# Altium project esp_dual.PrjPcb
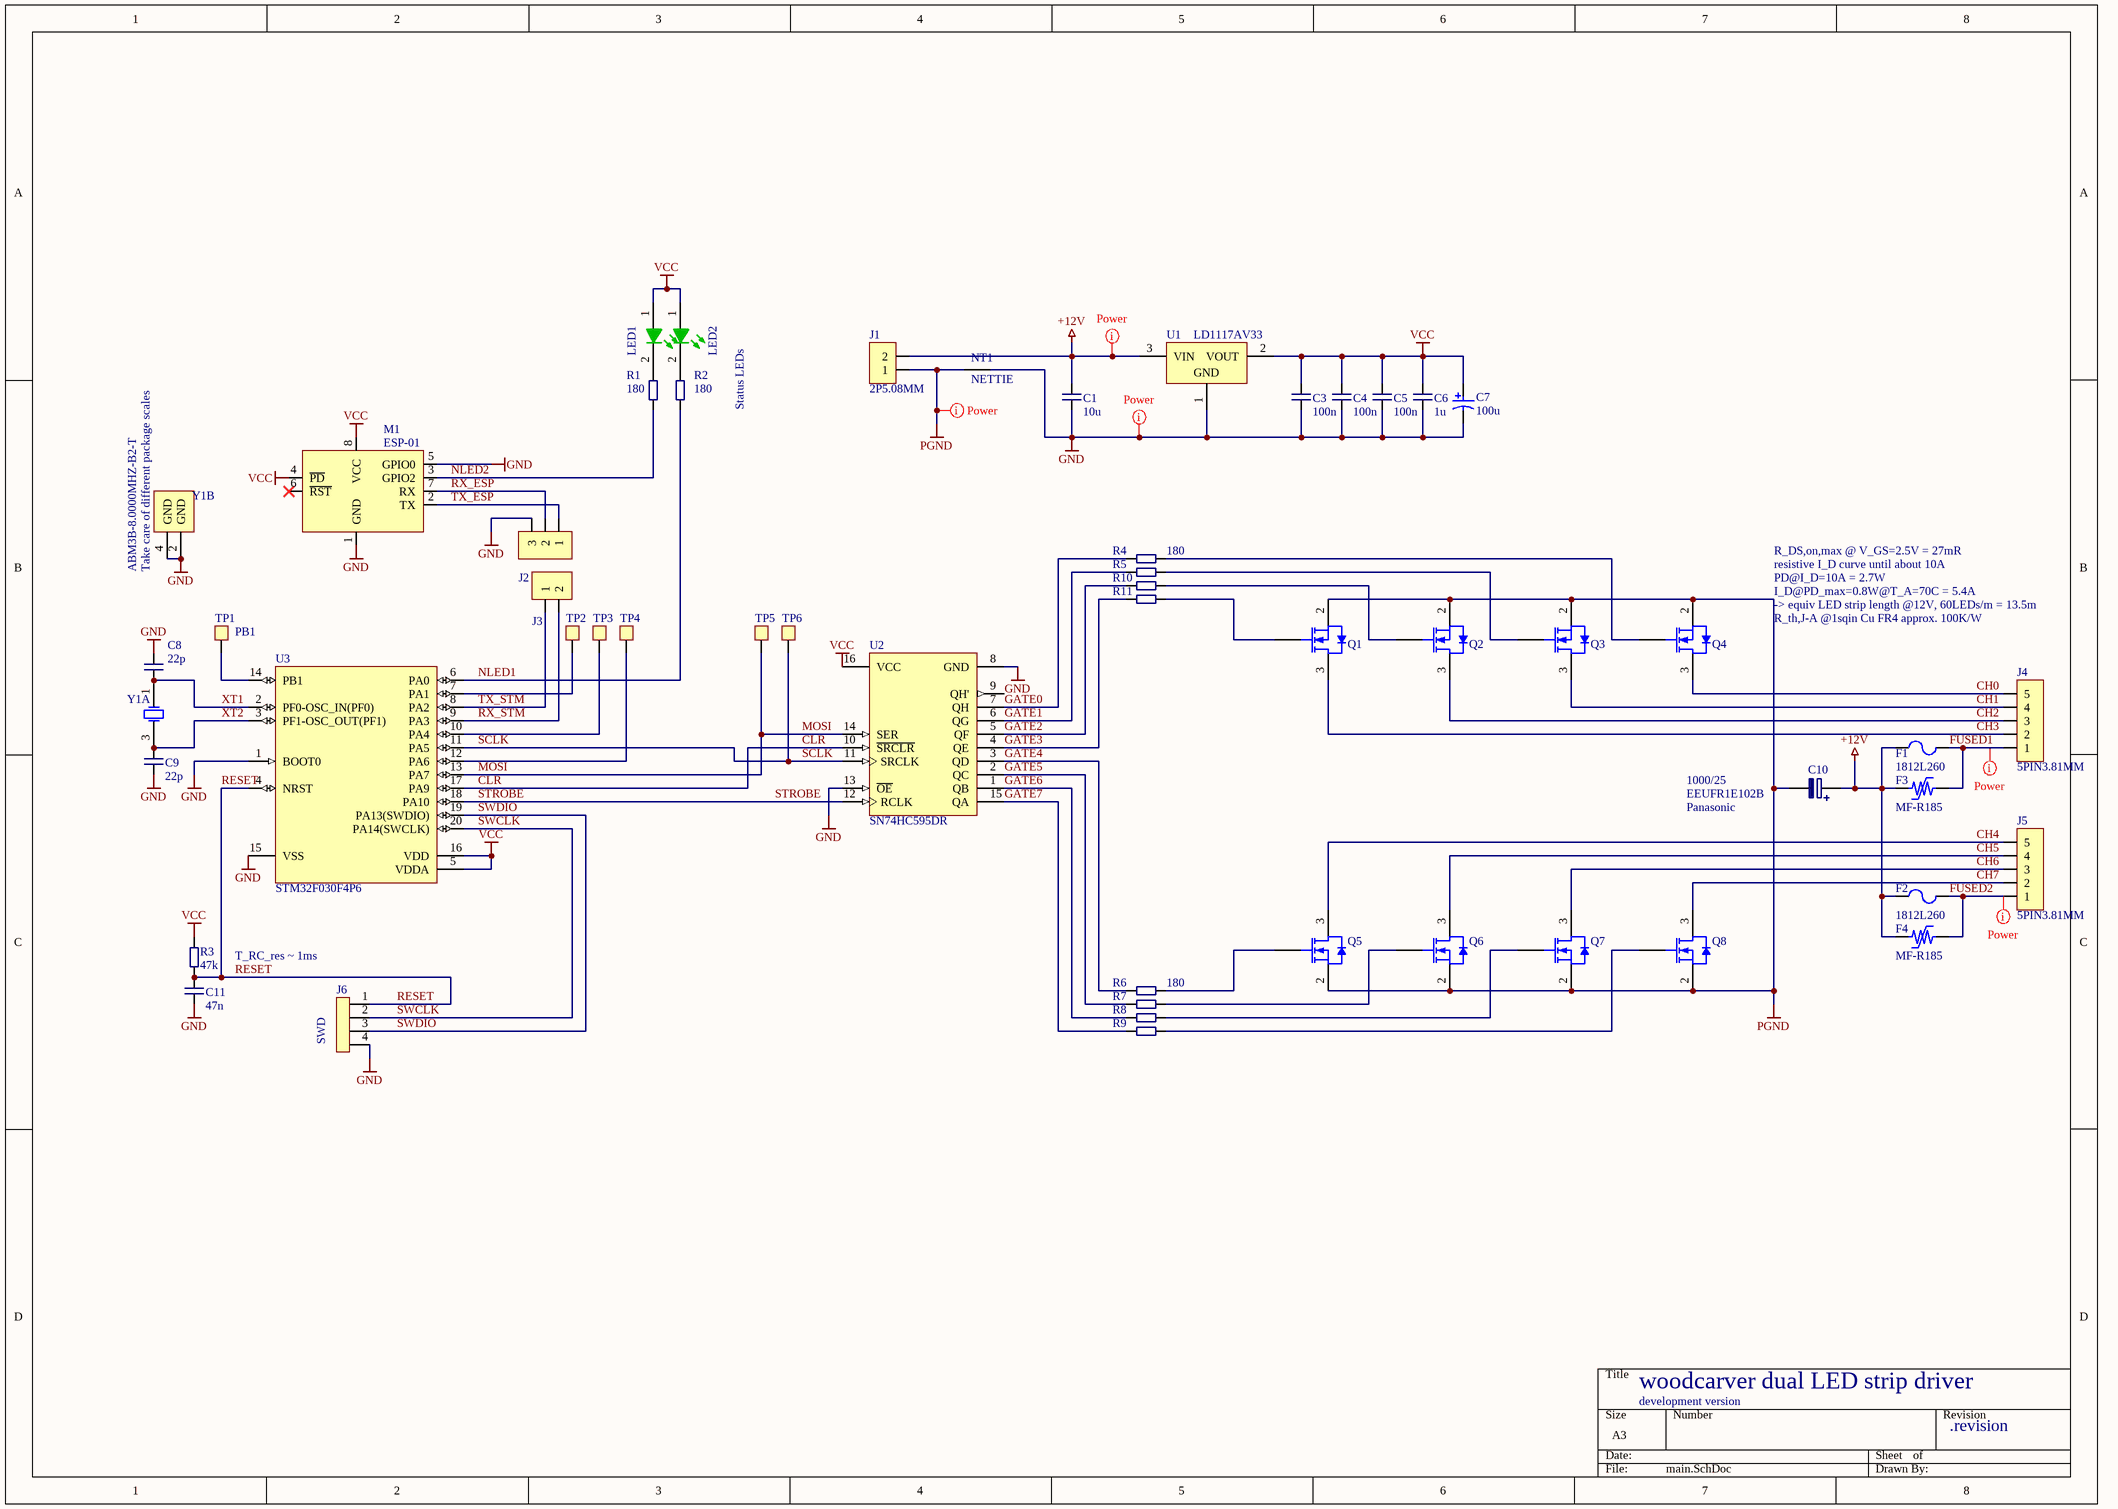
[diagram p0: main.SchDoc]
1 sheet, 53 parts. Net scope: global (net labels, ports and power ports of the same name join across sheets).
Board file: main.PcbDoc

## Sheet main.SchDoc
size A3; Revision: 1

### Parts
C1  10u  [6-0805_M]
C3  100n  [J1-0603]
C4  100n  [J1-0603]
C5  100n  [J1-0603]
C6  1u  [6-0805_M]
C7  100u  [FHTE-8-AA07-2_N]
C8  22p  [J1-0603]
C9  22p  [J1-0603]
C10  1000/25  Mfg Part No: EEUFR1E102B  Mfg: Panasonic  [ELKO_10MM_RM5_SIDE_25MM]
C11  47n  [J1-0603]
F1  1812L260  [LFUS-FUSE1812-71_V]
F2  1812L260  [LFUS-FUSE1812-71_V]
F3  MF-R185  [BOUR-MF-R185]
F4  MF-R185  [BOUR-MF-R185]
J1  2P5.08MM  [HEADER_2PIN_RM5.08MM_PLUGGABLE]
J2  PINHD_1x3_2.54MM  [PINHD_3X1_2.54MM]  (value not drawn)
J3  PINHD_1x2_2.54MM  [PINHD_2X1_2.54MM]  (value not drawn)
J4  5PIN3.81MM  [HEADER_5PIN_RM3.81MM_PLUGGABLE]
J5  5PIN3.81MM  [HEADER_5PIN_RM3.81MM_PLUGGABLE]
J6  SWD  [PINHD_4X1_2.54MM]
LED1  KP-1608MGC  [KING-0603LED_GREEN_V]  (value not drawn)
LED2  KP-1608MGC  [KING-0603LED_GREEN_V]  (value not drawn)
M1  ESP-01  [ESP01]
NT1  NETTIE  [NETTIE]
Q1  IRLML6244TRPbF  [ONSC-SOT-23-3-318-08_V]  (value not drawn)
Q2  IRLML6244TRPbF  [ONSC-SOT-23-3-318-08_V]  (value not drawn)
Q3  IRLML6244TRPbF  [ONSC-SOT-23-3-318-08_V]  (value not drawn)
Q4  IRLML6244TRPbF  [ONSC-SOT-23-3-318-08_V]  (value not drawn)
Q5  IRLML6244TRPbF  [ONSC-SOT-23-3-318-08_V]  (value not drawn)
Q6  IRLML6244TRPbF  [ONSC-SOT-23-3-318-08_V]  (value not drawn)
Q7  IRLML6244TRPbF  [ONSC-SOT-23-3-318-08_V]  (value not drawn)
Q8  IRLML6244TRPbF  [ONSC-SOT-23-3-318-08_V]  (value not drawn)
R1  180  [J1-0603]
R2  180  [J1-0603]
R3  47k  [J1-0603]
R4  180  [J1-0603]
R5  180  [J1-0603]  (value not drawn)
R6  180  [J1-0603]
R7  180  [J1-0603]  (value not drawn)
R8  180  [J1-0603]  (value not drawn)
R9  180  [J1-0603]  (value not drawn)
R10  180  [J1-0603]  (value not drawn)
R11  180  [J1-0603]  (value not drawn)
TP1  PB1  [TESTPOINT_2mm]
TP2  PA1  [TESTPOINT_2mm]  (value not drawn)
TP3  PA4  [TESTPOINT_2mm]  (value not drawn)
TP4  PA6  [TESTPOINT_2mm]  (value not drawn)
TP5  PA6  [TESTPOINT_2mm]  (value not drawn)
TP6  PA6  [TESTPOINT_2mm]  (value not drawn)
U1  LD1117AV33  [TO220]
U2  SN74HC595DR  [D0016A_M]
U3  STM32F030F4P6  [STM-TSSOP20_L]
Y1  ABM3B-8.0000MHZ-B2-T  [XTAL_MJ_5x3.2]  (value not drawn)  (parts A,B of 2)

### Nets
+12V: C1.1 C10.1 F1.1 F2.1 F3.1 F4.1 J1.2 U1.3(VIN)
GND: C1.2 C3.2 C4.2 C5.2 C6.2 C7.2 C8.1 C9.2 C11.2 J2.3 J6.4 M1.1(GND) M1.5(GPIO0) NT1.2 U1.1(GND) U2.8(GND) U2.13(~{OE}) U3.1(BOOT0) U3.15(VSS) Y1.2(GND) Y1.4(GND)
PGND: C10.2 J1.1 NT1.1 Q1.2(S) Q2.2(S) Q3.2(S) Q4.2(S) Q5.2(S) Q6.2(S) Q7.2(S) Q8.2(S)
VCC: C3.1 C4.1 C5.1 C6.1 C7.1 LED1.1(A) LED2.1(A) M1.4(~{PD}) M1.8(VCC) R3.2 U1.2(VOUT) U2.16(VCC) U3.5(VDDA) U3.16(VDD)
CH0: J4.5 Q4.3(D)
CH1: J4.4 Q3.3(D)
CH2: J4.3 Q2.3(D)
CH3: J4.2 Q1.3(D)
CH4: J5.5 Q5.3(D)
CH5: J5.4 Q6.3(D)
CH6: J5.3 Q7.3(D)
CH7: J5.2 Q8.3(D)
CLR: U2.10(~{SRCLR}) U3.17(PA9)
FUSED1: F1.2 F3.2 J4.1
FUSED2: F2.2 F4.2 J5.1
GATE0: R4.2 U2.7(QH)
GATE1: R5.2 U2.6(QG)
GATE2: R10.2 U2.5(QF)
GATE3: R11.2 U2.4(QE)
GATE4: R6.2 U2.3(QD)
GATE5: R7.2 U2.2(QC)
GATE6: R8.2 U2.1(QB)
GATE7: R9.2 U2.15(QA)
MOSI: TP5.1 U2.14(SER) U3.13(PA7)
NLED1: R2.1 U3.6(PA0)
NLED2: M1.3(GPIO2) R1.1
RESET: C11.1 J6.1 R3.1 U3.4(NRST)
RX_ESP: J2.2 M1.7(RX)
RX_STM: J3.2 U3.9(PA3)
SCLK: TP6.1 U2.11(SRCLK) U3.11(PA5)
STROBE: U2.12(RCLK) U3.18(PA10)
SWCLK: J6.2 U3.20(PA14(SWCLK))
SWDIO: J6.3 U3.19(PA13(SWDIO))
TX_ESP: J2.1 M1.2(TX)
TX_STM: J3.1 U3.8(PA2)
XT1: C8.2 U3.2(PF0-OSC_IN(PF0)) Y1.1(X1)
XT2: C9.1 U3.3(PF1-OSC_OUT(PF1)) Y1.3(X2)
NetLED1_2: LED1.2(K) R1.2
NetLED2_2: LED2.2(K) R2.2
NetQ1_1: Q1.1(G) R11.1
NetQ2_1: Q2.1(G) R10.1
NetQ3_1: Q3.1(G) R5.1
NetQ4_1: Q4.1(G) R4.1
NetQ5_1: Q5.1(G) R6.1
NetQ6_1: Q6.1(G) R7.1
NetQ7_1: Q7.1(G) R8.1
NetQ8_1: Q8.1(G) R9.1
NetTP1_1: TP1.1 U3.14(PB1)
NetTP2_1: TP2.1 U3.7(PA1)
NetTP3_1: TP3.1 U3.10(PA4)
NetTP4_1: TP4.1 U3.12(PA6)

Not connected (* = marked no-connect by the designer): M1 6(~{RST})*; U2 9(QH')

### Layout directives
net class power: +12V, FUSED1, FUSED2, GND, PGND

### Notes on the sheet
- Status LEDs
- R_DS,on,max @ V_GS=2.5V = 27mR
- resistive I_D curve until about 10A
- PD@I_D=10A = 2.7W
- I_D@PD_max=0.8W@T_A=70C = 5.4A
- -> equiv LED strip length @12V, 60LEDs/m = 13.5m
- R_th,J-A @1sqin Cu FR4 approx. 100K/W
- T_RC_res ~ 1ms
- woodcarver dual LED strip driver
- development version
- .revision

### Library data of the parts
C1 C3-C6 C8 C9 C11 = C: Capacitor
C7 = CMP-0909-00002-1: Aluminum Electrolytic Capacitor, 470 uF +/- 5%, 16 V, -40 to 105 degC, 2 Pin THD, Dia 6.3 mm, Body Length 7 mm, Tape and Reel; Manufacturer: Fenghuang Technology; PartNumber: 8471LCJAA07WPN081T; Nominal Capacitance: 470 uF; Tolerance: +/- 5%; Voltage: 16 V; Seeve Color: Balck; PackageReference: 8-AA07-2; ComponentLink1URL: http://www.fenghua-advanced.com/; DatasheetVersion: Feb-13; Packing: Tape and Reel; Mounting Technology: Through Hole; Operating Temperature: -40 to 105 degC; ComponentLink2URL: http://218.15.223.226:8089/BusinessProductPdf/ss_20130228152314.pdf; ComponentLink2Description: Datasheet; ComponentLink1Description: Manufacturer URL; PackageDescription: 2-Pin Through Hole Cap, Dia 6.3 mm, Body Length 7 mm
C10 = ELKO
F1 F2 = CMP-0257-00001-1: Resettable PTC, 1812, 1.5 A Ihold, 3.0 A Itrip; PartNumber: 1812L150ZR; Itrip: 3 A; Vmax: 8 Vdc; Ihold: 1.5 A; Imax: 100 A; PackageReference: FUSE1812-71; ComponentLink1Description: Manufacturer URL; DatasheetVersion: 6/2012; ComponentLink2URL: http://www.littelfuse.com/products/resettable-ptcs/surface-mount/1812l/~/media/Electronics_Technical/Datasheets/Resettable_PTCs/Littelfuse_PTC_1812L_Datasheet.pdf; PackageVersion: 6/2012; PackageDescription: 2-Pin SMT Fuse, 4.55 x 3.24 mm Body; ComponentLink1URL: http://www.littelfuse.com/; ComponentLink2Description: Datasheet
F3 F4 = CMP-2000-06695-1: PTC Resettable Fuse, 30 V, 40 A, -40 to 85 degC, 2-Pin THD, RoHS, Bulk; Manufacturer: Bourns; Maximum Current Rating: 40A; Maximum Initial Resistance: 0.07Ohm; Typical Power Dissipation: 1W; Maximum Voltage Rating: 30V; Maximum Post Trip Resistance: 0.11Ohm; Minimum Initial Resistance: 0.04Ohm; Wire Form: InsideCrimpStandoff; Lead Diameter: 0.51mm; COO: CN; Maximum Trip Time: 8.7@9.25As; Agency Approvals: CSA/TUV/UL; Hold Current: 1.85A; Trip Current: 3.7A; Manufacturer URL: http://www.bourns.com/; Applications: AutomotiveApplications,ComputersandPeripherals,GeneralElectronics; Datasheet URL: http://www.bourns.com/docs/Product-Datasheets/mfr.pdf; Terminal Pitch: 5.1(Nom)mm; Packaging: Bulk; Package/Case: N/A; Dimension: 3(Max)x12(Max)mm; Package Description: 2-Pin Through Hole Device, Body 12 x 3 mm; Family: MF-R; Mounting: ThroughHole; Supplier: Bourns; Seated Plane Height: 18.4(Max)mm; Part No: MF-R185; Number of Terminals: 2; Package Reference: MF-R185; RoHS: Yes; Supplier Standard Pack: 500; HTS: 8536100040; Datasheet Version: 08/2015; Operating Temperature: -40to85C; ECCN: EAR99; Mounting Technology: ThroughHole
J1 = PHD2P5.08RM: Pluggable Header 2 Pin RM 5.08mm ~15A
J2 = PINHD1X3: Pin Header 1 row 3 pin RM 2.54mm
J3 = PINHD1X2: Pin Header 1 row 2 pin RM 2.54mm
J4 J5 = PHD5P3.81RM: Pluggable Header 5 Pin RM 3.81mm ~8A
J6 = PH_4x1: Pin Header 4x1 pin
LED1 LED2 = CMP-0404-00001-1: LED, SMT, 0603(1608), 1.1mm thickness, Green; Manufacturer: Kingbright; Reverse Voltage: 5 V; Power Dissipation: 75 mW; Forward Current: 30 mA; Packing Type: 2000 pcs / reel; Mounting Technology: Surface Mount; Storage Temperature: -40 to +85 degC; ComponentLink1URL: http://www.kingbright.com/; PackageDescription: 2-Pin SMT LED, 1.6 x 0.8 mm Pitch; PartNumber: KP-1608MGC; PackageReference: 0603LED_GREEN; ComponentLink1Description: Manufacturer URL
M1 = ESP01: ESP-01 ESP8266 Wifi Module
Q1-Q8 = CMP-1058-00794-1: Power MOSFET, 500 mA, 60 V, N-Channel, 3-Pin SOT-23, Pb-Free, Tape and Reel; Manufacturer: On Semiconductor; PartNumber: NVBF170LT1G; ID Max (A): 0.5; V(BR)DSS Min (V): 60; Configuration: Single; Channel Polarity: N Channel; PD Max (W): 0.225; VGS(th) Max (V): 3; VGS Max (V): 20; ComponentLink3URL: http://www.onsemi.cn/pub_link/Collateral/318-08.PDF; Mounting Technology: Surface Mount; ComponentLink2URL: http://www.onsemi.cn/pub_link/Collateral/MMBF170LT1-D.PDF; RoHS: Pb-Free; ComponentLink2Description: Datasheet; ComponentLink1URL: http://www.onsemi.com/; Package Type: SOT-23-3; Packing: Tape and Reel; DatasheetVersion: Rev. 9; PackageDescription: 3-Pin Small Outline Transistor, Body 2.92 x 1.3 mm, Pitch 0.95 mm; PackageVersion: Rev. AP, 11/2009; ComponentLink3Description: Package Specification; ComponentLink1Description: Manufacturer URL; PackageReference: SOT-23-3-318-08
R1-R11 = R: Resistor
TP1-TP6 = TESTPOINT
U1 = CMP-0244-00460-1: 1A, Low Drop Positive Voltage Regulator, 3.3V, 3-Pin TO-220; ComponentLink1URL: http://www.st.com; PackageDescription: TO, Thru-Hole, Vertical, Heatsink Mounted; 3 In-Line Leads; Pitch 2.54 mm; PackageVersion: ver3.0; ComponentLink3URL: http://www.st.com/internet/com/TECHNICAL_RESOURCES/TECHNICAL_LITERATURE/PACKAGE_INFORMATION/CD00004649.pdf; ComponentLink3Description: Package Specification; ComponentLink1Description: Manufacturer URL; ComponentLink2URL: http://www.st.com/internet/com/TECHNICAL_RESOURCES/TECHNICAL_LITERATURE/DATASHEET/CD00002116.pdf; PackageReference: TO220; DatasheetVersion: 2/12/2011; ComponentLink2Description: Datasheet
U2 = CMP-0780-00037-3: 8-Bit Shift Registers With 3-State Output Registers, D0016A, LARGE T&R; Manufacturer: Texas Instruments; Output Drive (IOL/IOH)(Max)(mA): 7.8/-7.8; Rating: Military; ICC @ Nom Voltage(Max)(mA): 0.08; VCC(Min)(V): 2; tpd @ Nom Voltage(Max)(ns): 34; 3-State Output: Yes; Output Type: CMOS; Voltage(Nom)(V): 6; F @ Nom Voltage(Max)(Mhz): 28; Technology Family: HC; Bits: 4; PackageReference: D0016A; Code_JEDEC: MS-012 variation AC; Generic Part Number: SN74HC595; Operating Temperature Range(C): -40 to 85; DatasheetVersion: SCLS041H; PackageVersion: http://www.ti.com/lit/ml/mpds178g/mpds178g.pdf; Input Type: CMOS; VCC(Max)(V): 6
U3 = CMP-0304-00039-2: ARM Cortex-M0 32-bit MCU, 16 KB Flash, 4 KB Internal RAM, 15 I/Os, 20-pin TSSOP, -40 to 85 degC, Tube; I/Os (High Current): 15; FLASH Size (Prog) (kB): 16; Internal RAM Size (kB): 4; Supply Voltage(Vcc) min (V): 2.4; Operating Frequency(F) (Processor speed) (MHz): 48; ComponentLink2URL: http://www.st.com/st-web-ui/static/active/en/resource/technical/document/datasheet/DM00088500.pdf; Core: ARM Cortex-M0; ComponentLink2Description: Datasheet; PackageDescription: 20-Pin Thin Shrink Small Outline Package, 6.5 x 4.4 mm Body, 0.65 mm Pitch; Mounting Technology: Surface Mount; ComponentLink1URL: http://www.st.com/web/en/home.html; PackageVersion: Rev. 1, 11/2012; ComponentLink3Description: Package Specification; PartNumber: STM32F030F4P6; ComponentLink3URL: http://www.st.com/st-web-ui/static/active/en/resource/technical/document/datasheet/DM00065136.pdf; DatasheetVersion: Rev. 1; PackageReference: TSSOP20; ComponentLink1Description: Manufacturer URL; Packing: Tube
Y1 = ABRA-ABM3B-4: Crystal, SMD, 25.000000MHz Stab=50ppm 18.0pF; Manufacturer: Abracon; PartNumber: ABM3B-25.000MHZ-B2-T; Packing Type: Tape & Reel; Body Shape: Rectangular; Note: Take care of different package scales; Case Size: 5.0 x 3.2 mm; PackageDescription: 4-Pin SMT Crystal, 5.2 x 3.4 mm Body; ComponentLink2Description: Datasheet; Mounting Technology: Surface Mount; ComponentLink1URL: http://www.abracon.com/; PackageReference: ABM3B; DatasheetVersion: Apr-13; ComponentLink2URL: http://www.abracon.com/Resonators/abm3b.pdf; ComponentLink1Description: Manufacturer URL; Storage Temperature: -40 to 80 degC